# EAGLE design eeprom_shield (EAGLE 6.4)
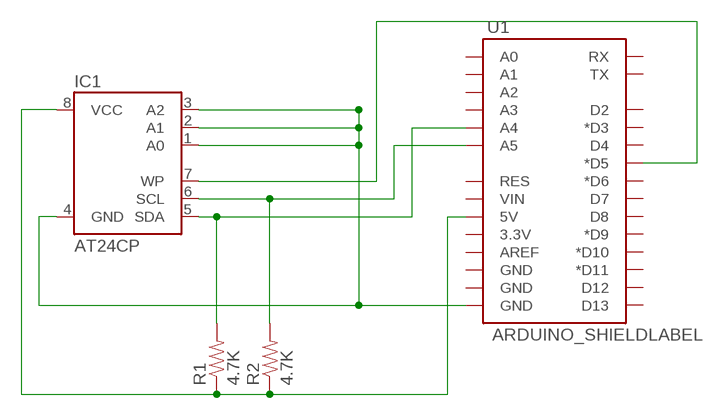
[diagram p0: schematic, sheet 1]

## Parts
IC1  AT24CP  [DIL08]
R1  4.7K  RESISTORPTH-1/4W  [AXIAL-0.4]
R2  4.7K  RESISTORPTH-1/4W  [AXIAL-0.4]
U1  ARDUINO_SHIELDLABEL  [DUEMILANOVE_SHIELD]

## Nets
N$1: IC1.1(A0) IC1.2(A1) IC1.3(A2) IC1.4(GND) U1.GND@0(GND)
N$2: IC1.6(SCL) R2.P$2 U1.A5
N$3: IC1.7(WP) U1.D5(*D5)
N$4: IC1.8(VCC) R1.P$1 R2.P$1 U1.5V
N$5: IC1.5(SDA) R1.P$2 U1.A4
Unconnected: U1.3.3V U1.A0 U1.A1 U1.A2 U1.A3 U1.AREF U1.D2 U1.D3(*D3) U1.D4 U1.D6(*D6) U1.D7 U1.D8 U1.D9(*D9) U1.D10(*D10) U1.D11(*D11) U1.D12 U1.D13 U1.GND@1(GND) U1.GND@2(GND) U1.RES U1.RX U1.TX U1.VIN

## Library data of the parts
IC1 = EEPROM:AT24C*: 2-wire serial EEPROM; MPN: AT24C1024BW-SH-B; OC_FARNELL: 1362646; OC_NEWARK: 03P2044
R1 R2 = SparkFun-Passives:RESISTOR: Resistor Basic schematic elements and footprints for 0603, 1206, and PTH resistors.
U1 = SparkFun-Boards:ARDUINO_SHIELD: Arduino shield footprint

## Board
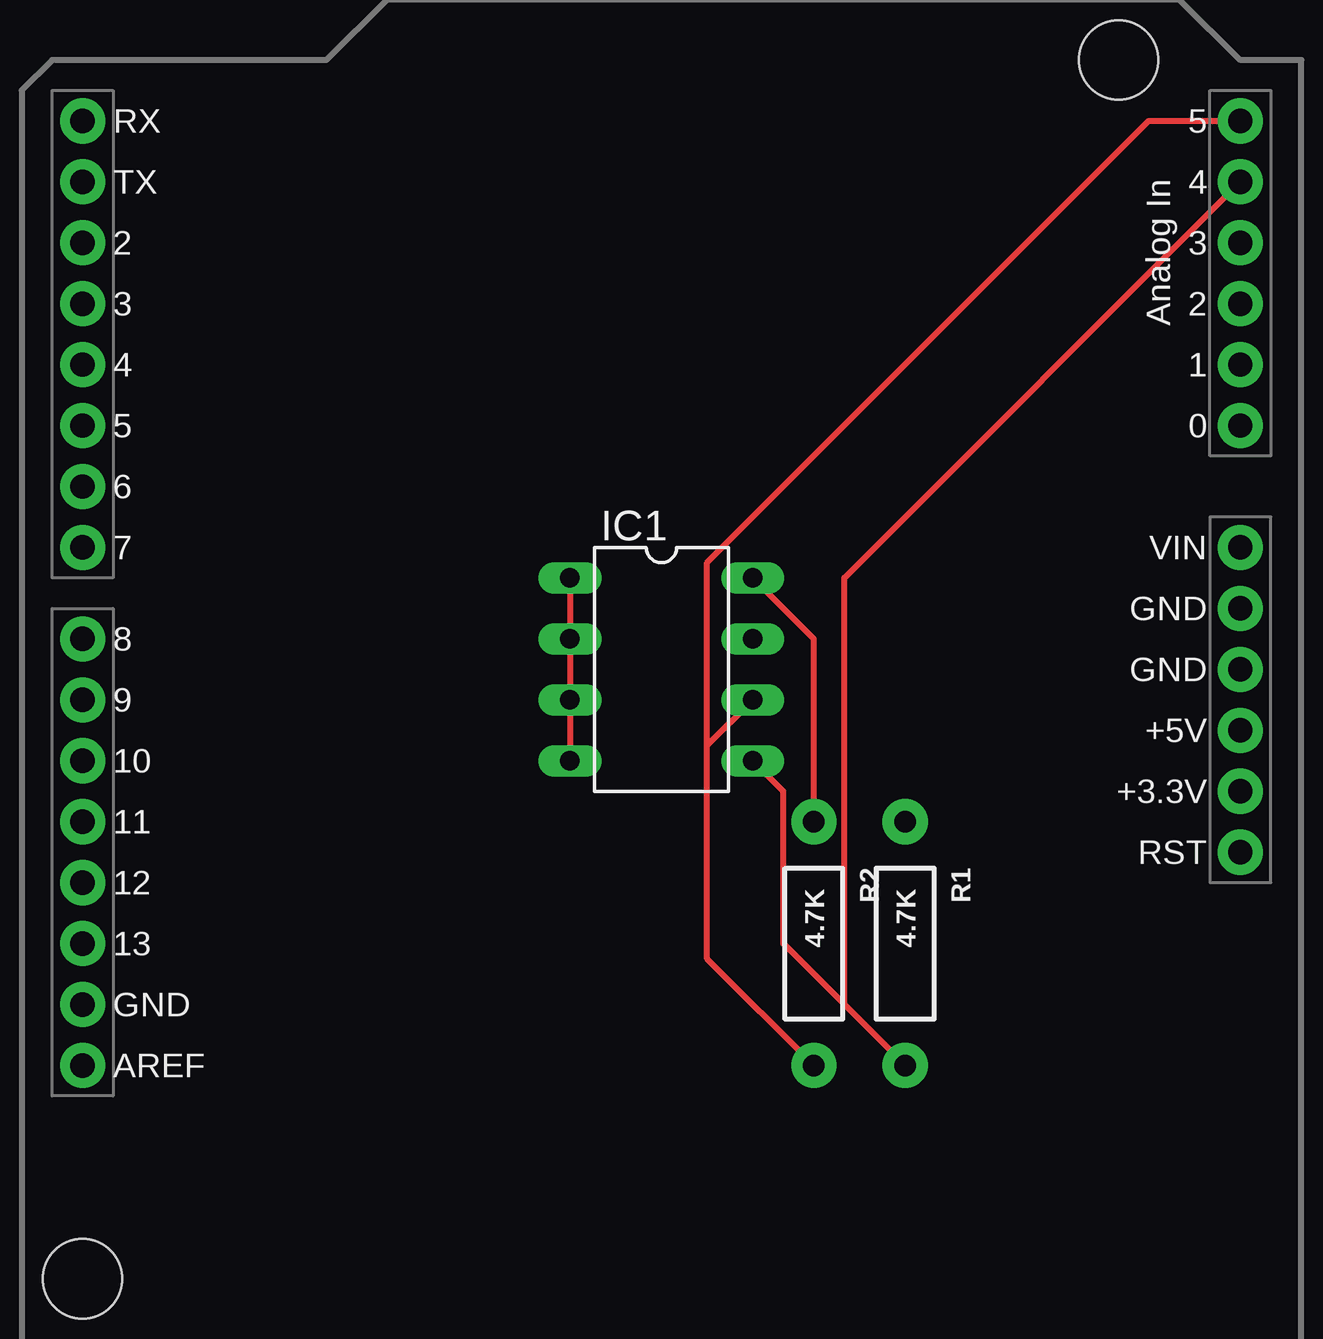
[diagram p1: board, top side]
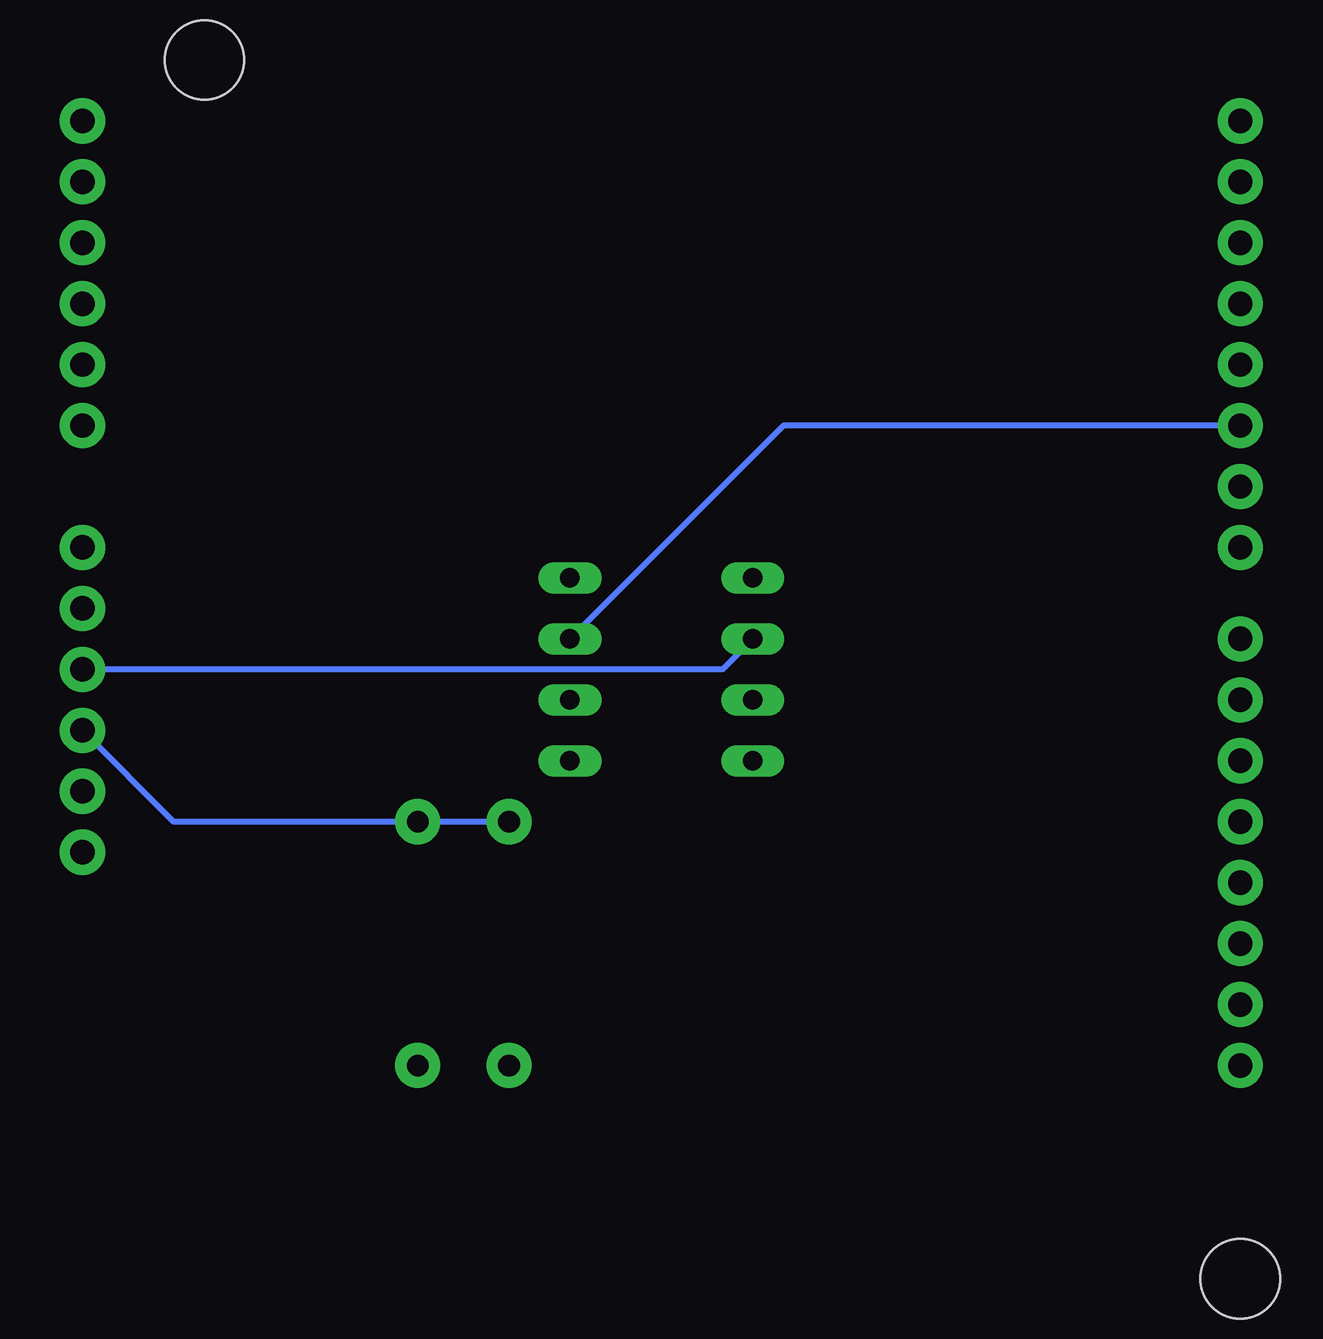
[diagram p2: board, bottom side, seen from below]

No outline drawn. Coordinates in mm, seen from the top.
Copper layers (1*16): Top 0.035mm / dielectric 1.5mm / Bottom 0.035mm
Design rules "default": minimum track width 10mil, minimum drill 24mil, track to track 8mil, track to pad 8mil, pad to pad 8mil, via to via 8mil, smd to smd 8mil, copper to edge 40mil, drill to drill 8mil, minimum pad ring 10mil, minimum via ring 8mil, stop-mask expansion 4mil, vias tented up to drill 0mil, thermal gap 10mil

### Footprints (pad centres in the part's own frame; a part is rotated, then mirrored left to right if it is on the bottom)
DIL08 = drill 0.813 long: 1 -3.81,-3.81; 2 -1.27,-3.81; 3 1.27,-3.81; 4 3.81,-3.81; 5 3.81,3.81; 6 1.27,3.81; 7 -1.27,3.81; 8 -3.81,3.81
AXIAL-0.4 = drill 0.9 pad 1.88: P$1 -5.08,0; P$2 5.08,0
DUEMILANOVE_SHIELD = drill 1.016 pad 1.88: 3.3V 50.8,26.67; 5V 50.8,29.21; A0 50.8,41.91; A1 50.8,44.45; A2 50.8,46.99; A3 50.8,49.53; A4 50.8,52.07; A5 50.8,54.61; AREF 2.54,15.24; D2 2.54,49.53; D3 2.54,46.99; D4 2.54,44.45; D5 2.54,41.91; D6 2.54,39.37; D7 2.54,36.83; D8 2.54,33.02; D9 2.54,30.48; D10 2.54,27.94; D11 2.54,25.4; D12 2.54,22.86; D13 2.54,20.32; GND@0 50.8,31.75; GND@1 50.8,34.29; GND@2 2.54,17.78; RES 50.8,24.13; RX 2.54,54.61; TX 2.54,52.07; VIN 50.8,36.83 | hole 3.302: 45.72,57.15; 2.54,6.35

### Placement (x,y rotation side)
IC1  26.67,31.75 270 top
R1  36.83,20.32 270 top
R2  33.02,20.32 270 top
U1  0,0 0 top

### Tracks (layer width: path | path; a pad name or v marks a point on that pad's centre or on a via)
N$1
  Top 0.254: IC1.4 IC1.3 IC1.2 IC1.1
  Bottom 0.254: U1.GND@0 24.13,31.75 IC1.2
N$2
  Top 0.254: 28.57,28.57 IC1.6 | 28.57,28.57 28.57,19.68 R2.P$2 | U1.A5 46.99,54.61 28.57,36.2 28.57,28.57
N$3
  Bottom 0.254: IC1.7 21.59,41.91 U1.D5
N$4
  Top 0.254: IC1.8 33.02,33.02 R2.P$1
  Bottom 0.254: R2.P$1 R1.P$1 46.99,25.4 U1.5V
N$5
  Top 0.254: IC1.5 31.75,26.67 31.75,20.32 34.29,17.78 | R1.P$2 34.29,17.78 | U1.A4 34.29,35.56 34.29,17.78